# EAGLE design Main_old (EAGLE 7.2.0)
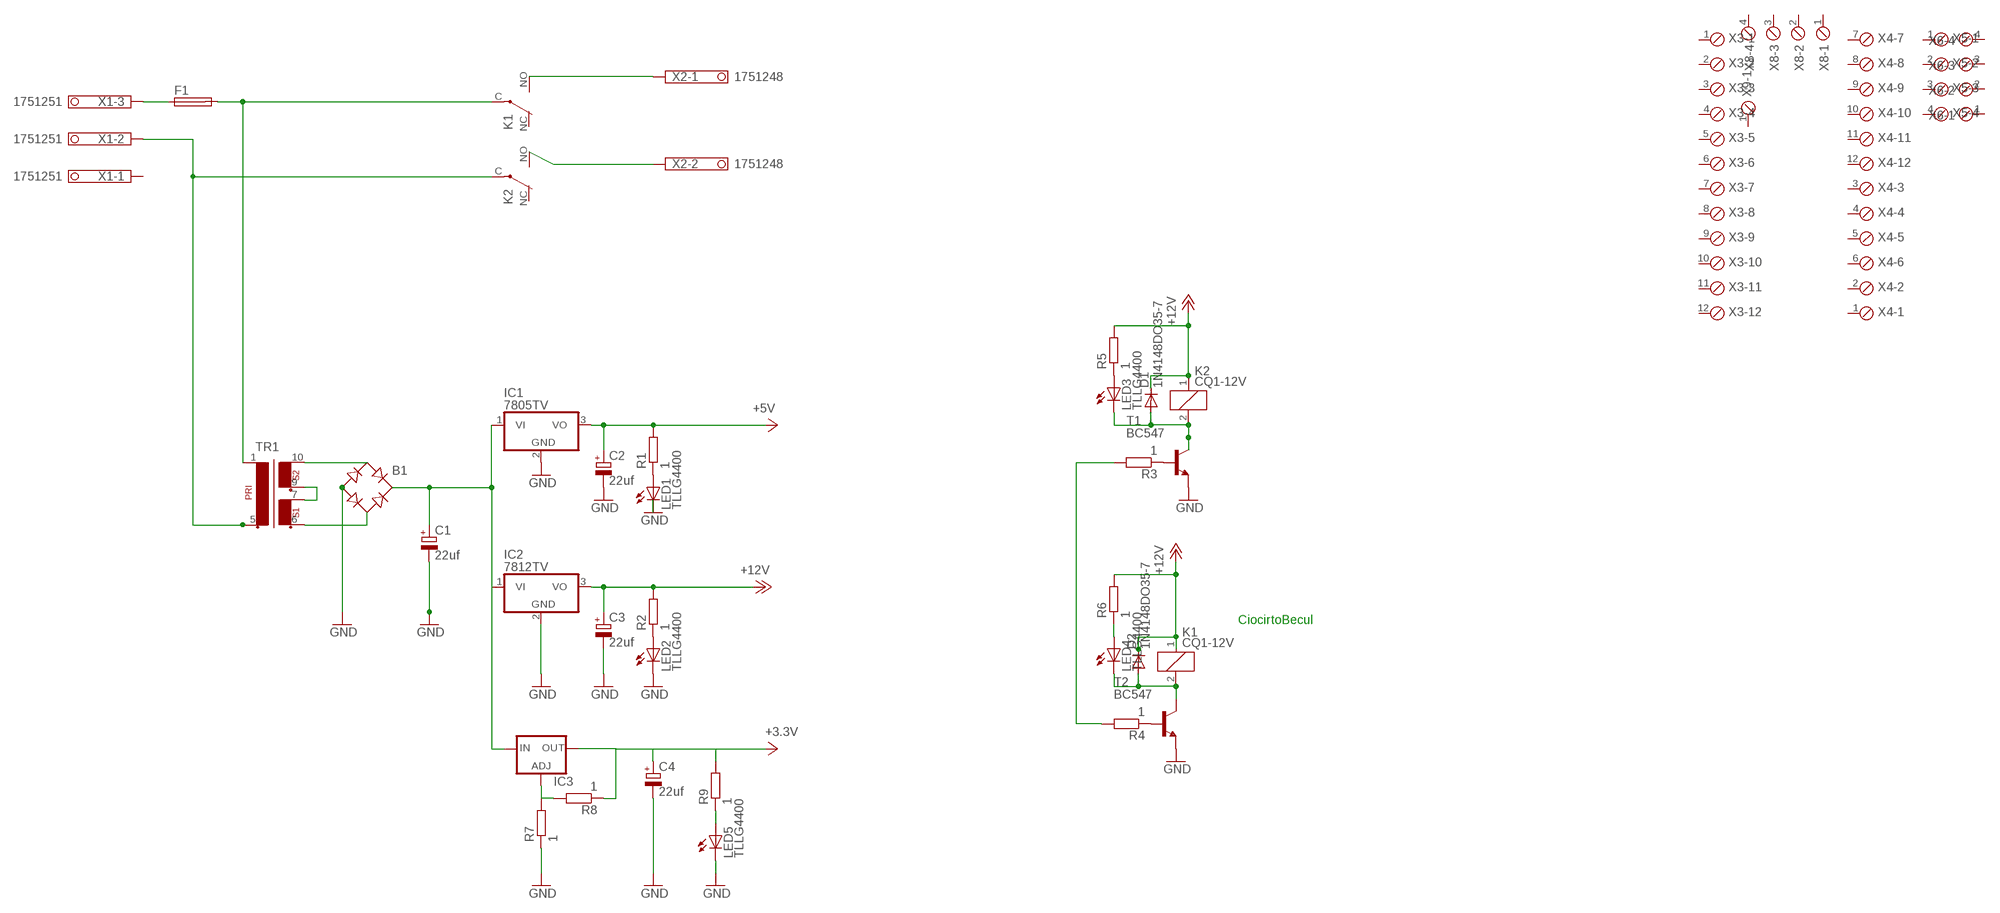
[diagram p0: schematic, sheet 1]

## Parts
B1  RB1A  [RB1A]
C1  22uf  CPOL-EUE2-4  [E2-4]
C2  22uf  CPOL-EUE2-4  [E2-4]
C3  22uf  CPOL-EUE2-4  [E2-4]
C4  22uf  CPOL-EUE2-4  [E2-4]
D1  1N4148DO35-7  [DO35-7]
D2  1N4148DO35-7  [DO35-7]
F1  SH25  [SH25]
IC1  7805TV  [TO220V]
IC2  7812TV  [TO220V]
IC3  LM317TS  [317TS]
K1  CQ1-12V  [CQ1]
K2  CQ1-12V  [CQ1]
LED1  TLLG4400  [LED3MM]
LED2  TLLG4400  [LED3MM]
LED3  TLLG4400  [LED3MM]
LED4  TLLG4400  [LED3MM]
LED5  TLLG4400  [LED3MM]
R1  1  R-EU_0204/5  [0204/5]
R2  1  R-EU_0204/5  [0204/5]
R3  1  R-EU_0204/5  [0204/5]
R4  1  R-EU_0204/5  [0204/5]
R5  1  R-EU_0204/5  [0204/5]
R6  1  R-EU_0204/5  [0204/5]
R7  1  R-EU_0204/5  [0204/5]
R8  1  R-EU_0204/5  [0204/5]
R9  1  R-EU_0204/5  [0204/5]
T1  BC547  [TO92]
T2  BC547  [TO92]
TR1  EI30-2  [EI30-2]
X1  1751251  [1751251]
X2  1751248  [1751248]
X3  MPT12  [12POL254]
X4  MPT12  [12POL254]
X5  MPT4  [4POL254]
X6  MPT4  [4POL254]
X8  MPT4  [4POL254]
X9  MPT2  [2POL254]

## Nets
+3.3V: C4.+ IC3.2(OUT) R8.1 R9.2
+5V: C2.+ IC1.3(VO) R1.2
+12V: C3.+ D1.C D2.C IC2.3(VO) K1.1 K2.1 R2.2 R5.2 R6.2
GND: B1.- C1.- C2.- C3.- C4.- IC1.2(GND) IC2.2(GND) LED1.K(C) LED2.K(C) LED5.K(C) R7.1 T1.1(E) T2.1(E)
N$1: F1.2 K1.C(2:P) TR1.1
N$2: K2.C(2:P) TR1.5 X1.2
N$3: K1.NO(2:S) X2.1
N$4: K2.NO(2:S) X2.2
N$5: TR1.7 TR1.9
N$6: B1.AC1 TR1.10
N$7: B1.AC2 TR1.6
N$8: B1.+ C1.+ IC1.1(VI) IC2.1(VI) IC3.3(IN)
N$9: D1.A K2.2 LED3.K(C) T1.3(C)
N$10: LED2.A R2.1
N$11: LED3.A R5.1
N$12: D2.A K1.2 LED4.K(C) T2.3(C)
N$13: LED1.A R1.1
N$14: R3.1 T1.2(B)
N$15: R4.1 T2.2(B)
N$16: R3.2 R4.2
N$17: F1.1 X1.3
N$18: LED4.A R6.1
N$19: IC3.1(ADJ) R7.2 R8.2
N$20: LED5.A R9.1
Unconnected: K1.NC(2:O) K2.NC(2:O) X1.1 X3.1 X3.2 X3.3 X3.4 X3.5 X3.6 X3.7 X3.8 X3.9 X3.10 X3.11 X3.12 X4.1 X4.2 X4.3 X4.4 X4.5 X4.6 X4.7 X4.8 X4.9 X4.10 X4.11 X4.12 X5.1 X5.2 X5.3 X5.4 X6.1 X6.2 X6.3 X6.4 X8.1 X8.2 X8.3 X8.4 X9.1 X9.2

## Notes on the sheet
- CiocirtoBecul

## Library data of the parts
B1 = rectifier:RB1A: RECTIFIER 1 A
C1-C4 = rcl:CPOL-EU: POLARIZED CAPACITOR, European symbol
D1 D2 = diode:1N4148: DIODE high speed (Philips)
F1 = fuse:SH25: FUSE HOLDER grid 25 mm, OGN0031 8211, Schurter (Buerklin); MF: SCHURTER; MPN: 0031.8211; OC_FARNELL: 1162741; OC_NEWARK: 96B9380
IC1 IC2 = linear:78*: Positive VOLTAGE REGULATOR Source: http://cache.national.com/ds/LM/LM78L05.pdf http://www.fairchildsemi.com/ds/LM/LM7805.pdf
IC3 = v-reg:LM317TS: VOLTAGE REGULATOR
K1 K2 = relay:CQ1-12V: AUTOMOTIVE QUIET RELAY NAiS Source: http://www.mew-europe.com/.. en_ds_61208_0000.pdf; OC_FARNELL: unknown; OC_NEWARK: unknown
LED1-LED5 = led:TLLG4400: Low Current (2mA) LED 3 mm Tinted Diffused Package color GREEN Source: Data sheet <http://www.farnell.com/datasheets/391098.pdf>; MF: VISHAY SEMICONDUCTOR; OC_FARNELL: 1612435
R1-R9 = rcl:R-EU_: RESISTOR, European symbol
T1 T2 = transistor:BC547: NPN TRANSISTOR
TR1 = trafo:EI30-2: TRANSFORMER 1 primary winding, 2 secondary windings ERA
X1 = con-phoenix-350:1751251: MKDS 1/ 3-3,5 Printklemme Nennstrom: 10 A Bemessungsspannung: 160 V Raster: 3,5 mm Polzahl: 3 Montageart: Löten Anschlussart: Schraubanschluss Anschlussrichtung vom Leiter zur Platine: 0° Source: http://eshop.phoenixcontact.com .. 1751251.pdf; OC_FARNELL: unknown; OC_NEWARK: unknown
X2 = con-phoenix-350:1751248: MKDS 1/ 2-3,5 Printklemme Nennstrom: 10 A Bemessungsspannung: 160 V Raster: 3,5 mm Polzahl: 2 Montageart: Löten Anschlussart: Schraubanschluss Anschlussrichtung vom Leiter zur Platine: 0° Source: http://eshop.phoenixcontact.com .. 1751248.pdf; OC_FARNELL: unknown; OC_NEWARK: unknown
X3 X4 = con-phoenix-254:MPT12: PHOENIX CONNECTOR; OC_FARNELL: unknown; OC_NEWARK: unknown
X5 X6 X8 = con-phoenix-254:MPT4: PHOENIX CONNECTOR; OC_FARNELL: unknown; OC_NEWARK: unknown
X9 = con-phoenix-254:MPT2: PHOENIX CONNECTOR; OC_FARNELL: unknown; OC_NEWARK: unknown

## Board
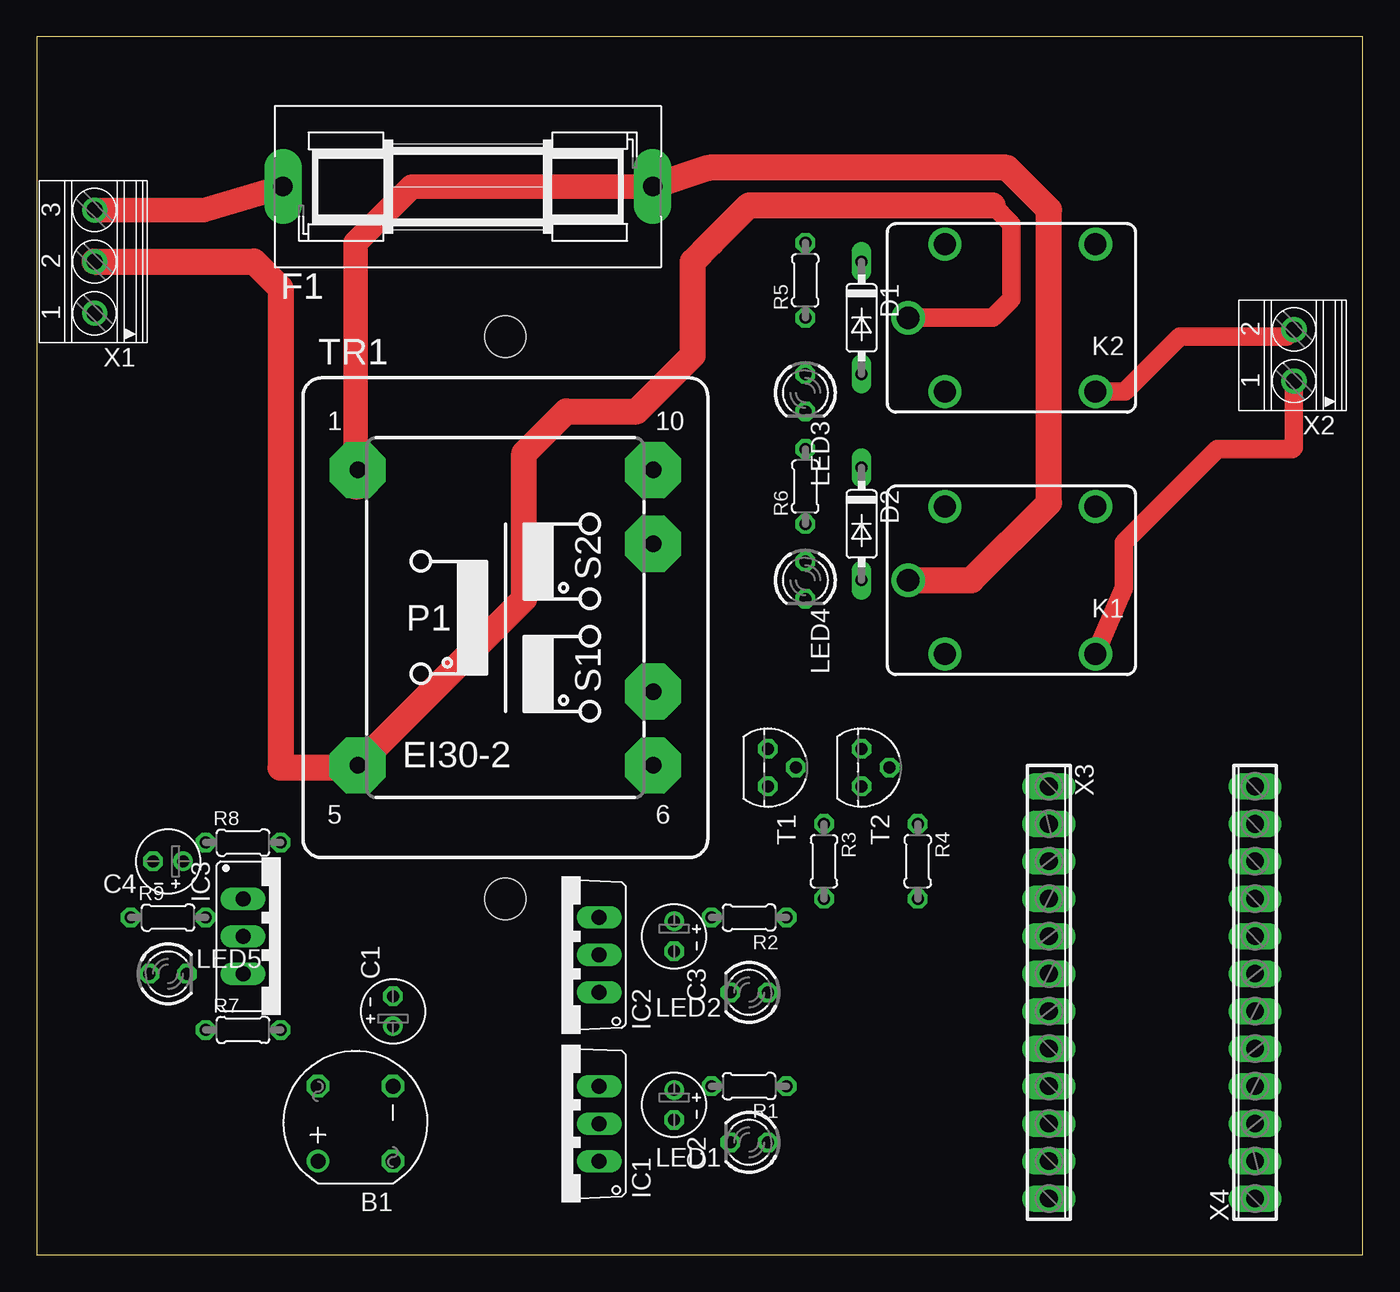
[diagram p1: board, top side]
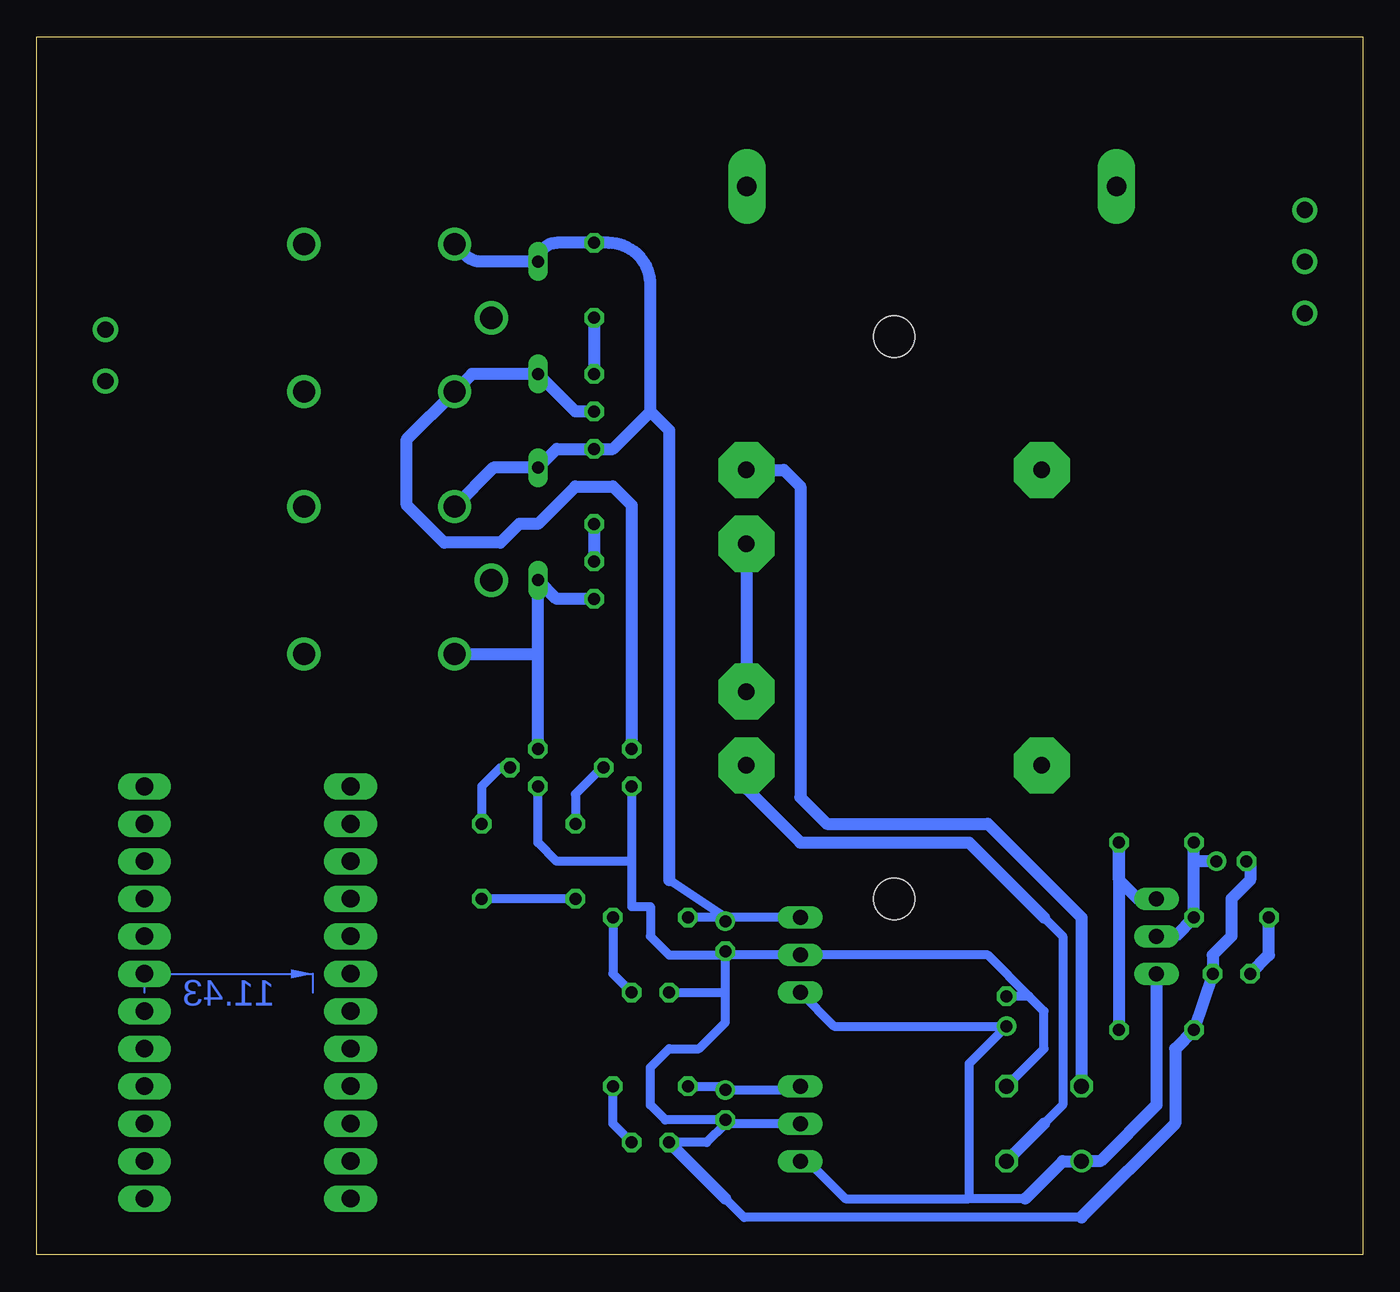
[diagram p2: board, bottom side, seen from below]

Size 89.84 x 82.54 mm. Coordinates in mm from the lower left corner, seen from the top.
Outline: 0,0 89.84,0 89.84,82.54 0,82.54 0,0
Copper layers (1*16): Top 0.035mm / dielectric 1.5mm / Bottom 0.035mm
Design rules "default": minimum track width 10mil, minimum drill 24mil, track to track 8mil, track to pad 8mil, pad to pad 8mil, via to via 8mil, smd to smd 8mil, copper to edge 40mil, drill to drill 8mil, minimum pad ring 10mil, minimum via ring 8mil, stop-mask expansion 4mil, vias tented up to drill 0mil, thermal gap 10mil
Holes 2.8 mm at 31.75,62.23 31.75,24.13

### Footprints (pad centres in the part's own frame; a part is rotated, then mirrored left to right if it is on the bottom)
RB1A = drill 1.016: + -2.54,2.54 | drill 1.016 octagon: - 2.54,-2.54; AC1 2.54,2.54; AC2 -2.54,-2.54
E2-4 = drill 0.813 pad 1.27: + -1.016,0 | drill 0.813 pad 1.27 octagon: - 1.016,0
DO35-7 = drill 0.813 long: A 3.81,0; C -3.81,0
SH25 = drill 1.321 pad 2.54 long: 1 -12.522,0; 2 12.522,0
TO220V = drill 1.016 long: 1 -2.54,-2.54; 2 0,-2.54; 3 2.54,-2.54
317TS = drill 1.016 long: 1 -2.54,-2.54; 2 0,-2.54; 3 2.54,-2.54
CQ1 = drill 1.5: 1 4.5,-5; 2 4.5,5; C 7,0; NC -5.7,-5; NO -5.7,5
LED3MM = drill 0.813 octagon: A -1.27,0; K 1.27,0
0204/5 = drill 0.813 octagon: 1 -2.54,0; 2 2.54,0
TO92 = drill 0.813 octagon: 1 1.27,0; 2 0,1.905; 3 -1.27,0
EI30-2 = drill 1.118 pad 3.81 octagon: 1 -10.008,10.008; 5 -10.008,-10.008; 6 10.008,-10.008; 7 10.008,-5.004; 9 10.008,5.004; 10 10.008,10.008
1751251 = drill 1.1 pad 1.7: 1 -3.5,-0.1; 2 0,-0.1; 3 3.5,-0.1
1751248 = drill 1.1 pad 1.7: 1 -1.75,-0.1; 2 1.75,-0.1
12POL254 = drill 1.2 long: 1 -13.97,0; 2 -11.43,0; 3 -8.89,0; 4 -6.35,0; 5 -3.81,0; 6 -1.27,0; 7 1.27,0; 8 3.81,0; 9 6.35,0; 10 8.89,0; 11 11.43,0; 12 13.97,0
4POL254 = drill 1.2 long: 1 -3.81,0; 2 -1.27,0; 3 1.27,0; 4 3.81,0
2POL254 = drill 1.2 long: 1 -1.27,0; 2 1.27,0

### Placement (x,y rotation side)
B1  21.59,8.89 90 top
C1  24.13,16.51 90 top
C2  43.18,10.16 270 top
C3  43.18,21.59 270 top
C4  8.89,26.67 180 top
D1  55.88,63.5 270 top
D2  55.88,49.53 270 top
F1  29.21,72.39 0 top
IC1  35.56,8.89 90 top
IC2  35.56,20.32 90 top
IC3  16.51,21.59 270 top
K1  66.04,45.72 180 top
K2  66.04,63.5 180 top
LED1  48.26,7.62 180 top
LED2  48.26,17.78 180 top
LED3  52.07,58.42 270 top
LED4  52.07,45.72 270 top
LED5  8.89,19.05 0 top
R1  48.26,11.43 180 top
R2  48.26,22.86 180 top
R3  53.34,26.67 270 top
R4  59.69,26.67 270 top
R5  52.07,66.04 90 top
R6  52.07,52.07 90 top
R7  13.97,15.24 0 top
R8  13.97,27.94 0 top
R9  8.89,22.86 0 top
T1  49.53,33.02 270 top
T2  55.88,33.02 270 top
TR1  31.75,43.18 0 top
X1  3.81,67.31 90 top
X2  85.09,60.96 90 top
X3  68.58,17.78 270 top
X4  82.55,17.78 90 top
X5  5.08,-87.63 0 top  (outside the outline)
X6  5.08,-93.98 0 top  (outside the outline)
X8  5.08,-74.93 0 top  (outside the outline)
X9  2.54,-81.28 0 top  (outside the outline)

### Tracks (layer width: path | path; a pad name or v marks a point on that pad's centre or on a via)
+3.3V
  Bottom 0.813: 11.43,26.67 R8.1 | C4.+ 11.43,26.67 | 11.43,26.67 R9.2 12.7,21.59 IC3.2
+5V
  Bottom 0.61: IC1.3 38.35,11.18 C2.+ 43.43,11.43 R1.2
+12V
  Bottom 0.61: IC2.3 42.93,22.86 C3.+ 43.18,22.86 | 43.18,22.86 R2.2 | 46.99,25.4 43.18,22.86
  Bottom 0.813: K2.1 60.77,67.73 arc-45 59.76,67.31 D1.C arc90 54.61,68.58 R5.2 51.1,68.58 arc90 48.26,65.74 48.26,57.15 | K1.1 58.92,53.34 D2.C 54.61,54.61 R6.2 50.8,54.61 48.26,57.15 | 48.26,57.15 46.99,55.88 46.99,25.4
GND
  Bottom 0.61: 37.85,8.64 IC1.2 42.93,8.89 C2.- | C2.- 43.18,8.89 44.45,7.62 LED1.K | LED2.K 43.18,17.78 | 43.18,17.78 43.18,20.32 | T1.1 49.53,26.67 | 49.53,26.67 54.61,26.67 55.88,27.94 T2.1 | 49.53,26.67 49.53,23.6 48.26,23.6 48.26,21.59 46.99,20.32 43.18,20.32 | 43.18,20.32 C3.- 42.93,20.32 IC2.2 25.4,20.32 22.61,17.53 | C2.- 47.24,9.14 48.26,10.16 48.26,12.7 46.99,13.97 44.98,13.97 43.18,15.77 43.18,17.78 | B1.- 21.59,13.97 21.59,16.51 22.61,17.53 | 22.61,17.53 C1.- 24.38,17.78 | 19.05,2.54 41.91,2.54 43.18,3.81
  Bottom 0.813: 43.18,3.81 LED1.K | C4.- 7.62,26.42 7.62,25.4 8.89,24.13 8.89,21.59 10.16,20.32 LED5.K R7.1 12.7,13.97 12.7,8.89 19.05,2.54
N$1
  Top 1.676: 21.59,52.07 21.59,68.58 25.4,72.39 F1.2
  Top 1.778: K1.C 63.34,45.72 68.58,50.96 68.58,70.82 65.74,73.66 45.54,73.66 F1.2 | 21.59,52.07 21.74,52.07 TR1.1
N$2
  Top 1.27: 64.77,71.12 66.04,69.85 66.04,64.77 64.77,63.5 K2.C
  Top 1.778: X1.2 14.71,67.31 16.51,65.51 16.51,33.02 21.74,33.02 TR1.5 33.02,44.45 33.02,54.31 35.86,57.15 40.64,57.15 43.18,59.69 44.45,60.96 44.45,67.31 45.72,68.58 48.26,71.12 64.77,71.12
N$3
  Top 1.27: X2.1 85.19,54.71 85.09,54.61 80.01,54.61 73.66,48.26 73.66,45.18 K1.NO
N$4
  Top 1.27: K2.NO 73.74,58.5 77.47,62.23 84.71,62.23 X2.2
N$5
  Bottom 0.813: TR1.9 TR1.7
N$6
  Bottom 0.813: TR1.10 39.22,53.19 38.1,52.07 38.1,31.01 36.3,29.21 25.4,29.21 19.05,22.86 B1.AC1
N$7
  Bottom 0.61: 21.59,22.86 20.32,21.59 20.32,10.16 21.59,8.89
  Bottom 0.813: TR1.6 41.76,31.6 38.1,27.94 26.67,27.94 21.59,22.86 | 21.59,8.89 B1.AC2
N$8
  Bottom 0.61: 22.86,3.81 26.67,3.81 | 26.67,3.81 26.67,12.95 C1.+ 35.81,15.49 IC2.1 37.85,18.03 | IC1.1 37.85,6.6 35.05,3.81 26.67,3.81
  Bottom 0.813: IC3.3 13.97,10.16 17.78,6.35 B1.+ 20.32,6.35 22.86,3.81
N$9
  Bottom 0.813: LED3.K 53.34,57.15 D1.A 60.35,59.69 K2.2 64.77,55.27 64.77,50.8 62.23,48.26 58.42,48.26 57.15,49.53 55.88,49.53 53.34,52.07 50.8,52.07 49.53,50.8 T1.3
N$10
  Bottom 0.61: R2.1 50.8,19.05 LED2.A
N$11
  Bottom 0.813: R5.1 LED3.A
N$12
  Bottom 0.813: LED4.K 54.61,44.45 D2.A 55.88,40.64 | T2.3 55.88,40.64 | K1.2 55.96,40.72 55.88,40.64
N$13
  Bottom 0.61: LED1.A 50.8,8.89 R1.1
N$14
  Bottom 0.61: T1.2 51.54,33.02 53.34,31.22 R3.1
N$15
  Bottom 0.61: T2.2 58.42,33.02 59.69,31.75 R4.1
N$16
  Bottom 0.61: R3.2 R4.2
N$17
  Top 1.676: X1.3 11.3,70.81 F1.1
N$18
  Bottom 0.813: R6.1 LED4.A
N$19
  Bottom 0.813: IC3.1 15.24,24.13 16.51,25.4 R8.2 R7.2
N$20
  Bottom 0.813: LED5.A 6.35,20.32 R9.1
(copper drawn outside any net)
  shapes: Bottom area x1